# EAGLE design spinkler_02 (EAGLE 7.3.0)
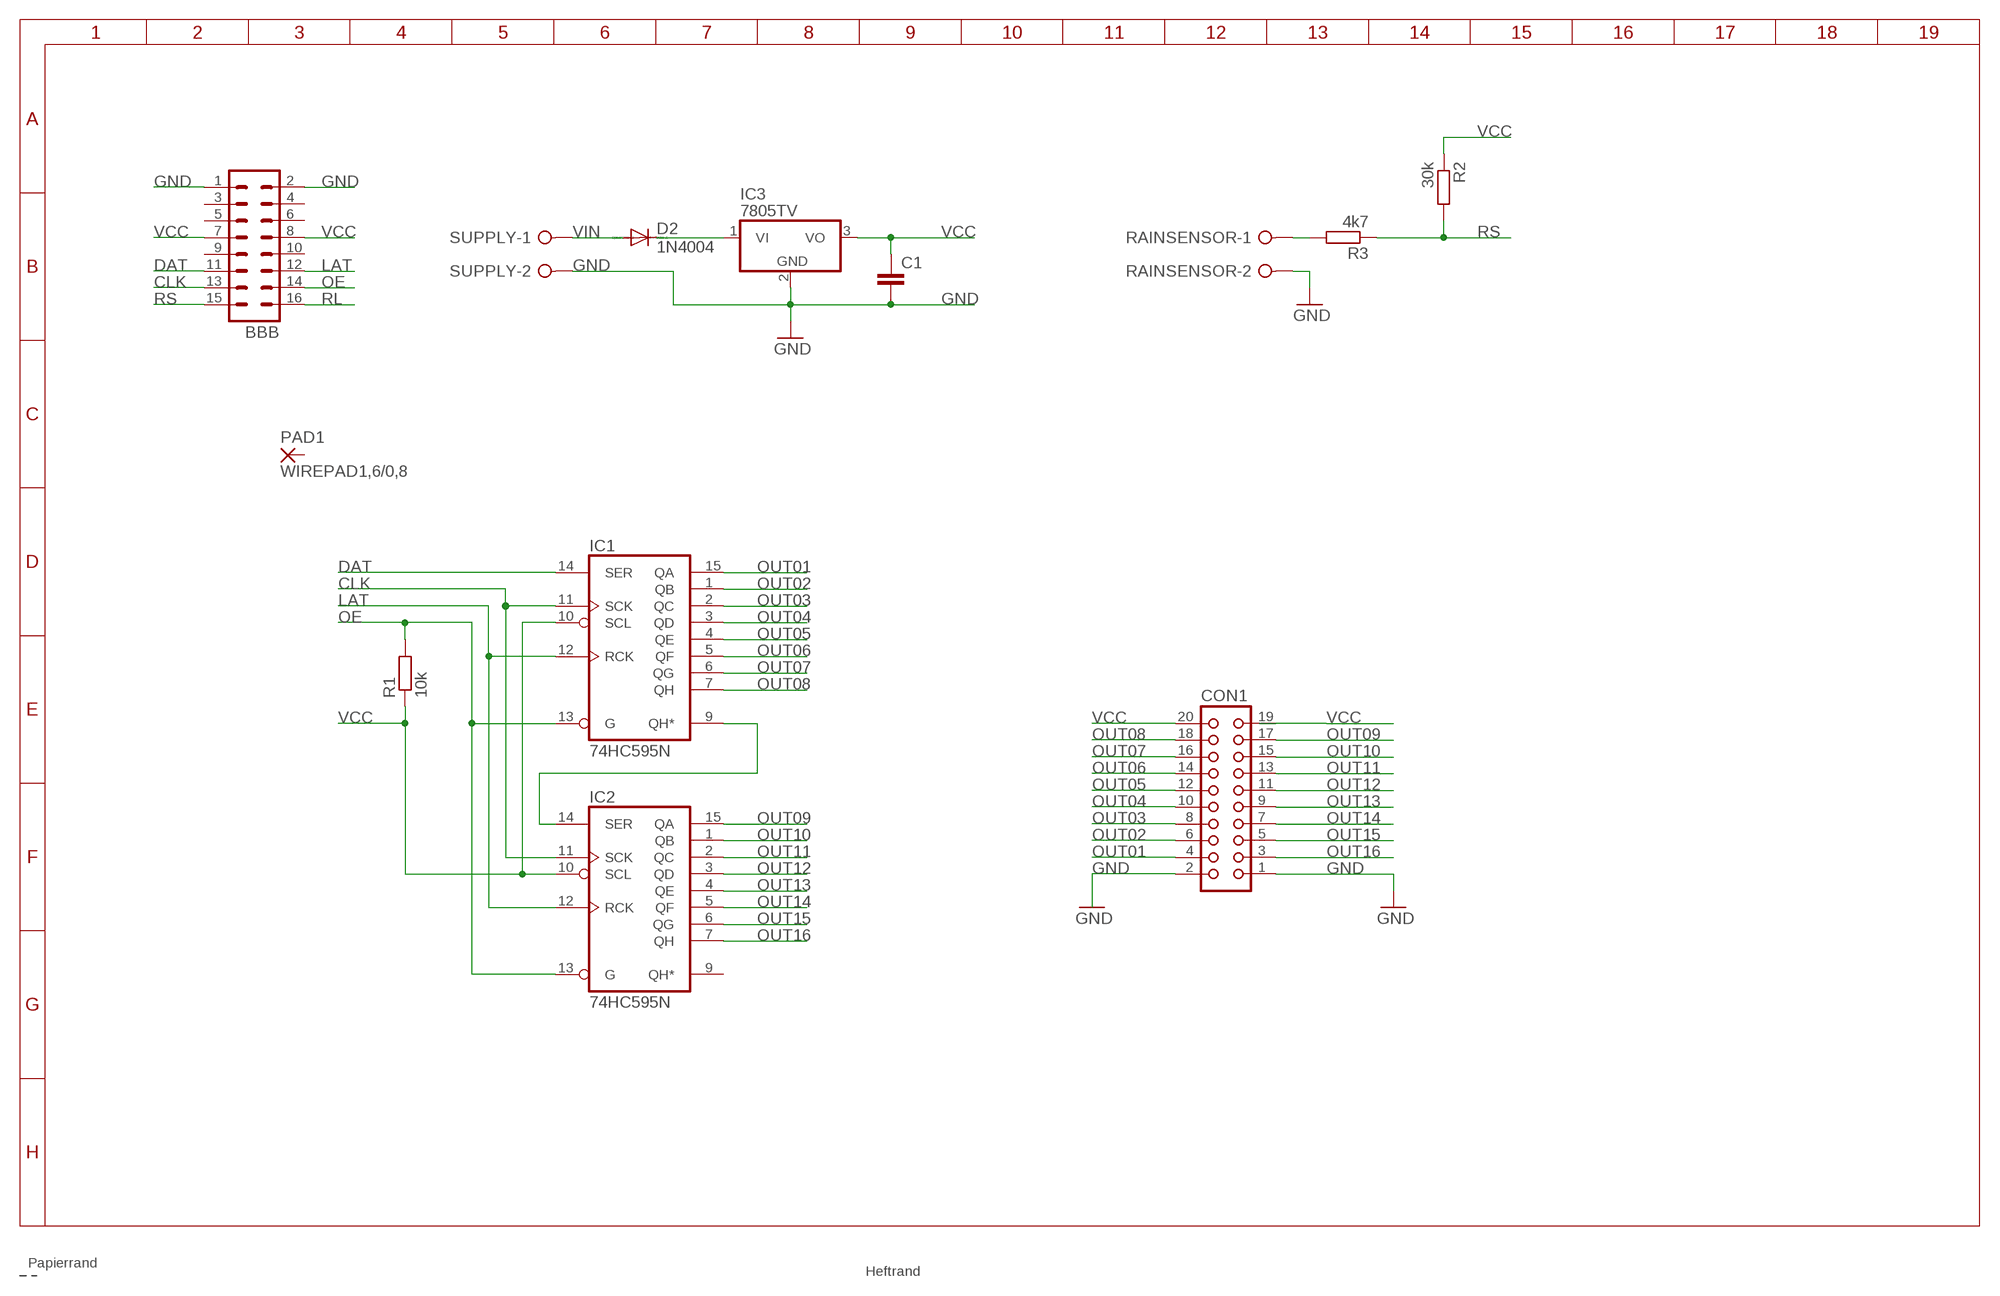
[diagram p0: schematic, sheet 1]

## Parts
BBB  MA08-2  [MA08-2]
C1  C-EU050-025X075  [C050-025X075]
CON1  CON20  [CON20]
D2  1N4004  [DO41-10]
IC1  74HC595N  [DIL16]
IC2  74HC595N  [DIL16]
IC3  7805TV  [TO220V]
PAD1  WIREPAD1,6/0,8  [1,6/0,8]
R1  10k  R-EU_0207/10  [0207/10]
R2  30k  R-EU_0207/10  [0207/10]
R3  4k7  R-EU_0207/10  [0207/10]
RAINSENSOR  W237-02P  [W237-132]
SUPPLY  W237-02P  [W237-132]

## Nets
CLK: BBB.13 IC1.11(SCK) IC2.11(SCK)
DAT: BBB.11 IC1.14(SER)
GND: BBB.1 BBB.2 C1.2 CON1.1 CON1.2 IC3.2(GND) RAINSENSOR.2 SUPPLY.2
LAT: BBB.12 IC1.12(RCK) IC2.12(RCK)
N$1: R3.2 RAINSENSOR.1
N$2: D2.C IC3.1(VI)
N$5: IC1.9(QH*) IC2.14(SER)
OE: BBB.14 IC1.13(G) IC2.13(G) R1.2
OUT01: CON1.4 IC1.15(QA)
OUT02: CON1.6 IC1.1(QB)
OUT03: CON1.8 IC1.2(QC)
OUT04: CON1.10 IC1.3(QD)
OUT05: CON1.12 IC1.4(QE)
OUT06: CON1.14 IC1.5(QF)
OUT07: CON1.16 IC1.6(QG)
OUT08: CON1.18 IC1.7(QH)
OUT09: CON1.17 IC2.15(QA)
OUT10: CON1.15 IC2.1(QB)
OUT11: CON1.13 IC2.2(QC)
OUT12: CON1.11 IC2.3(QD)
OUT13: CON1.9 IC2.4(QE)
OUT14: CON1.7 IC2.5(QF)
OUT15: CON1.5 IC2.6(QG)
OUT16: CON1.3 IC2.7(QH)
RL: BBB.16
RS: BBB.15 R2.2 R3.1
VCC: BBB.7 BBB.8 C1.1 CON1.19 CON1.20 IC1.10(SCL) IC2.10(SCL) IC3.3(VO) R1.1 R2.1
VIN: D2.A SUPPLY.1
Unconnected: BBB.3 BBB.4 BBB.5 BBB.6 BBB.9 BBB.10 IC2.9(QH*) PAD1.1(P)

## Power pins joined to a net without a drawn wire
GND: IC1.8(GND) IC2.8(GND)
VCC: IC1.16(VCC) IC2.16(VCC)

## Library data of the parts
BBB = con-lstb:MA08-2: PIN HEADER; OC_FARNELL: unknown; OC_NEWARK: unknown
C1 = resistor:C-EU: CAPACITOR, European symbol
CON1 = con-harting:CON20: CONNECTOR; OC_FARNELL: unknown; OC_NEWARK: unknown
D2 = diode:1N4004: DIODE general purpose rectifier, 1 A
IC1 IC2 = 74xx-eu:74*595: 8-bit SHIFT REGISTER, output latch
IC3 = linear:78*: Positive VOLTAGE REGULATOR Source: http://cache.national.com/ds/LM/LM78L05.pdf http://www.fairchildsemi.com/ds/LM/LM7805.pdf
PAD1 = wirepad:WIREPAD: Wire PAD connect wire on PCB
R1-R3 = rcl:R-EU_: RESISTOR, European symbol
RAINSENSOR SUPPLY = con-wago-508:W237-02P: WAGO SREW CLAMP; OC_FARNELL: unknown; OC_NEWARK: unknown

## Board
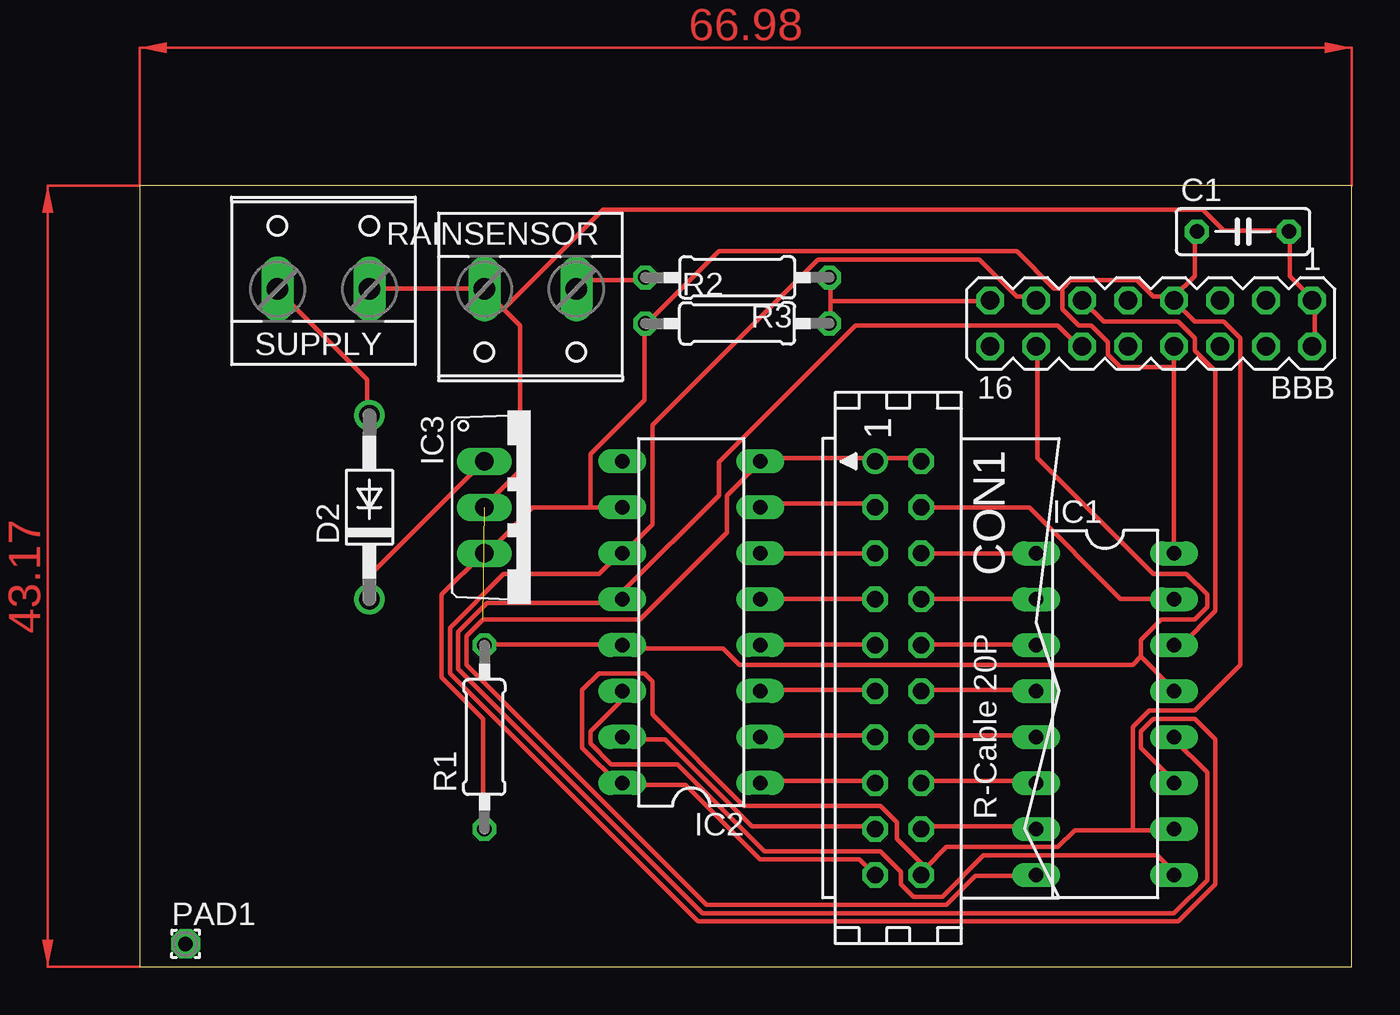
[diagram p1: board, top side]

Size 66.98 x 43.17 mm. Coordinates in mm from the lower left corner, seen from the top.
Outline: 0,0 66.98,0 66.98,43.17 0,43.17 0,0
Copper layers (1*16): Top 0.035mm / dielectric 1.5mm / Bottom 0.035mm
Design rules "default": minimum track width 10mil, minimum drill 24mil, track to track 8mil, track to pad 8mil, pad to pad 8mil, via to via 8mil, smd to smd 8mil, copper to edge 40mil, drill to drill 8mil, minimum pad ring 10mil, minimum via ring 8mil, stop-mask expansion 4mil, vias tented up to drill 0mil, thermal gap 10mil

### Footprints (pad centres in the part's own frame; a part is rotated, then mirrored left to right if it is on the bottom)
MA08-2 = drill 1.016 octagon: 1 -8.89,-1.27; 2 -8.89,1.27; 3 -6.35,-1.27; 4 -6.35,1.27; 5 -3.81,-1.27; 6 -3.81,1.27; 7 -1.27,-1.27; 8 -1.27,1.27; 9 1.27,-1.27; 10 1.27,1.27; 11 3.81,-1.27; 12 3.81,1.27; 13 6.35,-1.27; 14 6.35,1.27; 15 8.89,-1.27; 16 8.89,1.27
C050-025X075 = drill 0.813 octagon: 1 -2.54,0; 2 2.54,0
CON20 = drill 0.914: 1 -11.43,-1.27 | drill 0.914 octagon: 2 -11.43,1.27; 3 -8.89,-1.27; 4 -8.89,1.27; 5 -6.35,-1.27; 6 -6.35,1.27; 7 -3.81,-1.27; 8 -3.81,1.27; 9 -1.27,-1.27; 10 -1.27,1.27; 11 1.27,-1.27; 12 1.27,1.27; 13 3.81,-1.27; 14 3.81,1.27; 15 6.35,-1.27; 16 6.35,1.27; 17 8.89,-1.27; 18 8.89,1.27; 19 11.43,-1.27; 20 11.43,1.27
DO41-10 = drill 1.118: A 5.08,0; C -5.08,0
DIL16 = drill 0.813 long: 1 -8.89,-3.81; 2 -6.35,-3.81; 3 -3.81,-3.81; 4 -1.27,-3.81; 5 1.27,-3.81; 6 3.81,-3.81; 7 6.35,-3.81; 8 8.89,-3.81; 9 8.89,3.81; 10 6.35,3.81; 11 3.81,3.81; 12 1.27,3.81; 13 -1.27,3.81; 14 -3.81,3.81; 15 -6.35,3.81; 16 -8.89,3.81
TO220V = drill 1.016 long: 1 -2.54,-2.54; 2 0,-2.54; 3 2.54,-2.54
1,6/0,8 = drill 0.813 pad 1.6 octagon: 1 0,0
0207/10 = drill 0.813 octagon: 1 -5.08,0; 2 5.08,0
W237-132 = drill 1.194 long: 1 -2.54,-0.635; 2 2.54,-0.635

### Placement (x,y rotation side)
BBB  55.88,35.56 180 top
C1  60.96,40.64 0 top
CON1  41.91,16.51 270 top
D2  12.7,25.4 90 top
IC1  53.34,13.97 270 top
IC2  30.48,19.05 90 top
IC3  21.59,25.4 270 top
PAD1  2.54,1.27 0 top
R1  19.05,12.7 90 top
R2  33.02,35.56 0 top
R3  33.02,38.1 180 top
RAINSENSOR  21.59,36.83 180 top
SUPPLY  10.16,38.1 0 top

### Tracks (layer width: path | path; a pad name or v marks a point on that pad's centre or on a via)
CLK
  Top 0.254: IC1.11 57.15,10.29 55.32,12.12 55.32,13.03 56.01,13.72 58.29,13.72 59.44,12.57 59.44,4.57 57.38,2.52 30.86,2.52 17.14,16.23 17.14,18.75 20.12,21.72 25.38,21.72 26.52,22.86 IC2.11 26.75,22.86 28.35,24.46 28.35,29.95 37.49,39.09 46.41,39.09 48.46,37.03 49.38,37.03 BBB.13
DAT
  Top 0.254: IC1.14 57.15,17.83 57.61,17.83 59.44,19.66 59.44,32.92 58.29,34.06 58.29,34.75 57.38,35.66 53.26,35.66 52.12,36.8 BBB.11
GND  (1 unrouted)
  Top 0.254: CON1.2 42.98,28.12 40.69,28.12 CON1.1 40.46,28.12 34.29,28.12 IC2.8 34.29,27.89 32.46,26.06 32.46,24 27.66,19.2 18.97,19.2 18.06,18.29 18.06,16.69 31.32,3.43 44.58,3.43 46.18,5.03 49.38,5.03 IC1.8 | BBB.2 64.92,34.29 64.92,36.8 BBB.1 64.69,37.03 63.55,38.18 63.55,40.46 C1.2 63.32,40.69 59.89,40.69 58.75,41.83 25.6,41.83 20.12,36.35 | 20.12,36.35 19.2,37.26 RAINSENSOR.2 18.97,37.49 12.8,37.49 SUPPLY.2 | 20.12,36.35 21.03,35.43 21.03,27.43 19.2,25.6 IC3.2
LAT
  Top 0.254: BBB.12 51.89,34.29 50.75,35.43 39.55,35.43 32,27.89 32,26.06 26.75,20.8 26.75,20.34 IC2.12 26.52,20.12 19.2,20.12 17.6,18.52 17.6,16.46 31.09,2.97 57.15,2.97 58.98,4.8 58.98,10.74 57.15,12.57 IC1.12
N$1
  Top 0.254: R3.2 27.89,37.95 24.69,37.95 24.23,37.49 RAINSENSOR.1
N$2
  Top 0.254: IC3.1 18.97,27.89 12.8,21.72 12.8,20.34 D2.C
N$5
  Top 0.254: IC2.14 26.52,15.09 26.52,14.63 24.92,13.03 24.92,12.34 26.06,11.2 29.72,11.2 34.52,6.4 40.92,6.4 42.06,5.26 42.06,4.57 42.75,3.89 44.35,3.89 46.63,6.17 56.24,6.17 57.15,5.26 IC1.9
OE
  Top 0.254: R1.2 19.2,17.83 26.52,17.83 IC2.13 26.75,17.6 32.23,17.6 33.15,16.69 54.86,16.69 55.32,17.14 | 55.32,17.14 57.15,15.32 IC1.13 | 55.32,17.14 55.32,18.06 56.46,19.2 58.29,19.2 58.98,19.89 58.98,20.57 57.84,21.72 56.01,21.72 49.61,28.12 49.61,34.29 BBB.14
OUT01
  Top 0.254: IC1.15 57.15,20.34 54.18,20.34 49.15,25.38 43.2,25.38 CON1.4
OUT02
  Top 0.254: CON1.6 IC1.1
OUT03
  Top 0.254: IC1.2 49.38,20.34 43.2,20.34 CON1.8
OUT04
  Top 0.254: IC1.3 49.38,17.83 43.2,17.83 CON1.10
OUT05
  Top 0.254: IC1.4 49.38,15.32 43.2,15.32 CON1.12
OUT06
  Top 0.254: IC1.5 49.38,12.8 43.2,12.8 CON1.14
OUT07
  Top 0.254: IC1.6 49.38,10.29 43.2,10.29 CON1.16
OUT08
  Top 0.254: IC1.7 49.38,7.77 43.2,7.77 CON1.18
OUT09
  Top 0.254: IC2.15 26.75,12.57 29.03,12.57 33.83,7.77 40.46,7.77 CON1.17
OUT10
  Top 0.254: IC2.1 34.29,10.29 40.46,10.29 CON1.15
OUT11
  Top 0.254: IC2.2 34.29,12.8 40.46,12.8 CON1.13
OUT12
  Top 0.254: IC2.3 34.29,15.32 40.46,15.32 CON1.11
OUT13
  Top 0.254: IC2.4 34.29,17.83 40.46,17.83 CON1.9
OUT14
  Top 0.254: IC2.5 34.29,20.34 40.46,20.34 CON1.7
OUT15
  Top 0.254: CON1.5 IC2.6
OUT16
  Top 0.254: IC2.7 34.29,25.6 40.46,25.6 CON1.3
RS
  Top 0.254: 38.18,36.8 38.18,37.95 R3.1 | 38.18,36.8 38.18,35.66 R2.2 | 38.18,36.8 46.86,36.8 BBB.15
VCC
  Top 0.254: 54.86,7.54 51.66,7.54 50.75,6.63 44.58,6.63 43.43,5.49 | 54.86,7.54 57.15,7.54 IC1.10 | 43.43,5.49 43.2,5.26 CON1.20 43.43,5.49 | CON1.19 39.78,5.94 34.29,5.94 30.18,10.06 26.75,10.06 IC2.16 26.52,10.06 24.46,12.12 24.46,15.32 25.38,16.23 27.89,16.23 28.35,15.77 28.35,13.95 33.38,8.91 40.92,8.91 41.83,8 41.83,7.09 43.43,5.49 | 57.15,37.03 58.29,38.18 58.29,40.46 C1.1 | BBB.8 57.15,33.15 | 57.15,33.15 IC1.16 | 57.15,37.03 56.01,37.03 55.09,37.95 51.44,37.95 50.98,37.49 | 50.98,37.49 50.98,36.35 51.89,35.43 52.58,35.43 53.49,34.52 53.49,33.83 54.18,33.15 57.15,33.15 | 57.15,37.03 BBB.7 57.15,36.8 58.29,35.66 59.89,35.66 60.81,34.75 60.81,16.69 58.29,14.17 55.78,14.17 54.86,13.26 54.86,7.54 | R1.1 18.97,7.77 18.97,13.72 16.69,16 16.69,20.57 18.97,22.86 IC3.3 19.2,22.86 21.72,25.38 24.92,25.38 | 24.92,25.38 26.52,25.38 IC2.10 | 24.92,25.38 24.92,28.35 27.89,31.32 27.89,35.43 R2.1 28.12,35.66 32,39.55 48.46,39.55 50.52,37.49 50.98,37.49
VIN
  Top 0.254: D2.A 12.57,30.63 12.57,32.46 7.77,37.26 SUPPLY.1
(copper drawn outside any net)
  shapes: Top area x2